# Altium schematic sheet MCU.SchDoc
size A3
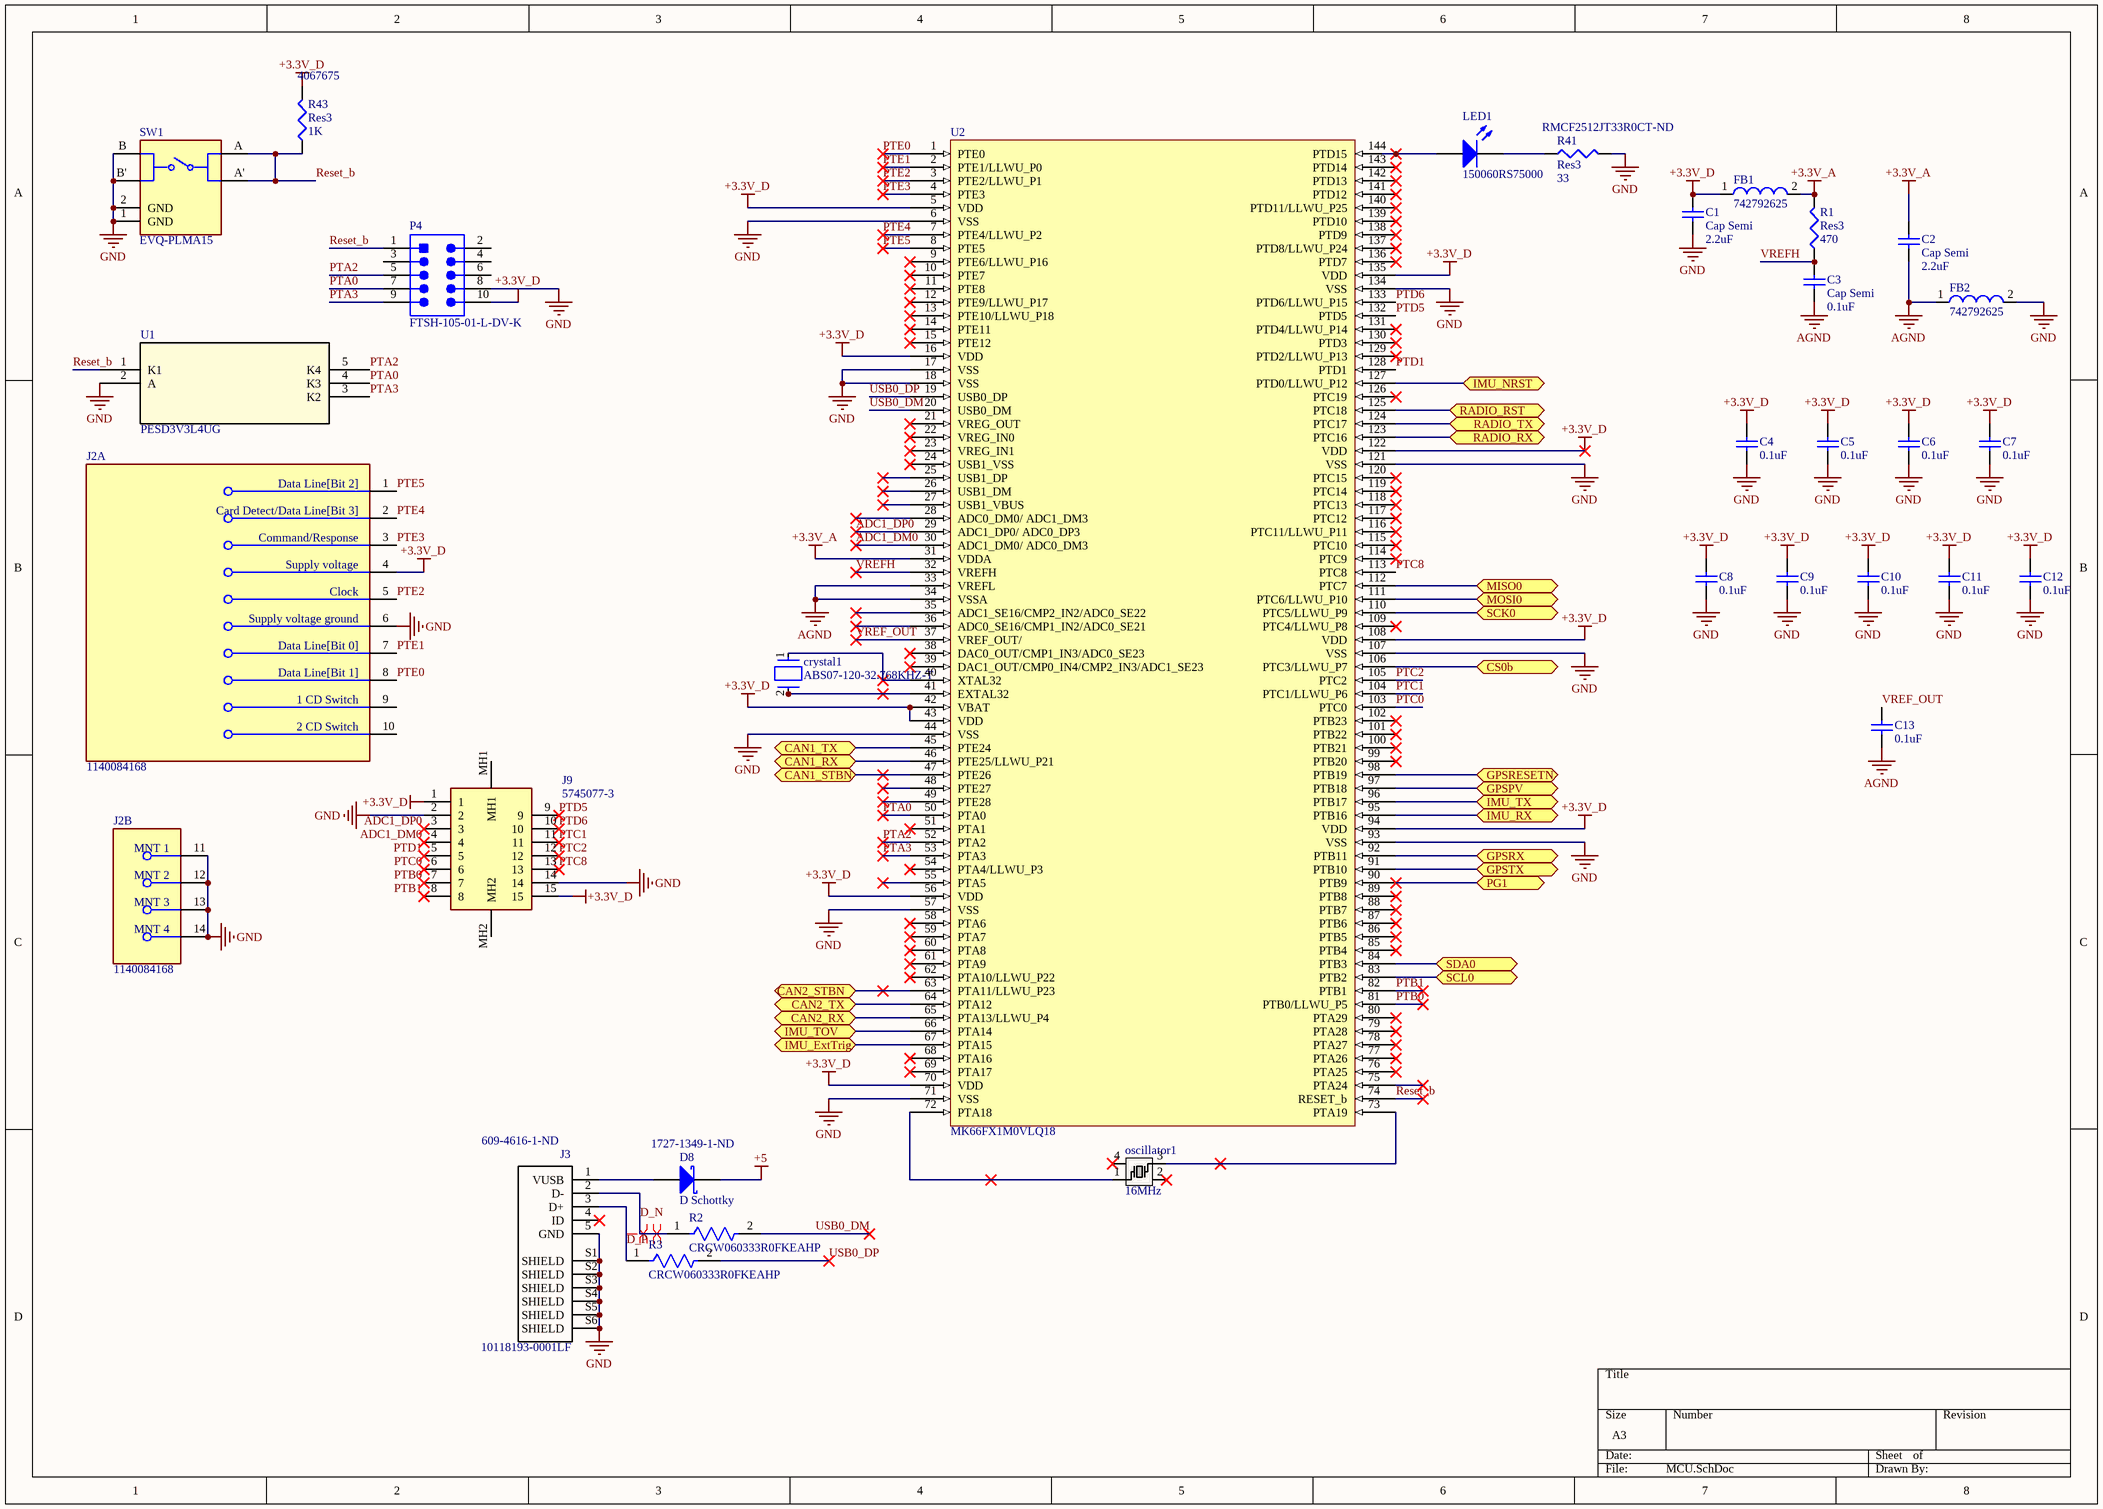
[diagram p0: MCU.SchDoc]

## Parts
C1  Cap Semi  value 2.2uF  [C1206]
C2  Cap Semi  value 2.2uF  [C1206]
C3  Cap Semi  value 0.1uF  [C1206]
C4  0.1uF  [J1-0603]
C5  0.1uF  [J1-0603]
C6  0.1uF  [J1-0603]
C7  0.1uF  [J1-0603]
C8  0.1uF  [J1-0603]
C9  0.1uF  [J1-0603]
C10  0.1uF  [J1-0603]
C11  0.1uF  [J1-0603]
C12  0.1uF  [J1-0603]
C13  0.1uF  [J1-0603]
crystal1  ABS07-120-32.768KHZ-T  [FP-ABS07-120-MFG]
D8  D Schottky  Supplier Part Number 1: 1727-1349-1-ND  [DIO_PMEG6030EVPX]
FB1  742792625  [SMD-0603]
FB2  742792625  [SMD-0603]
J2  1140084168  [FP-1140084168-0]  (parts A,B of 2)
J3  10118193-0001LF  Supplier Part Number 1: 609-4616-1-ND  [FCI_10118193-0001LF_10118193-0001LF(Primary)]
J9  5745077-3  [2301840-1]
LED1  150060RS75000  [0603_A]
oscillator1  value 16MHz  [ECS-160-8-30B-CKM]  (hidden comment: SMD_oscillator)
P4  FTSH-105-01-L-DV-K  [SMTC-FTSH-105-01-L-DV-K_V]
R1  Res3  value 470  [J1-0603]
R2  CRCW060333R0FKEAHP  [FP-CRCW0603-HPe3-IPC_B]
R3  CRCW060333R0FKEAHP  [FP-CRCW0603-HPe3-IPC_B]
R41  Res3  value 33  Supplier Part Number 2: RMCF2512JT33R0CT-ND  [J1-0603]
R43  Res3  value 1K  Supplier Part Number 1: 4067675  [J1-0603]
SW1  EVQ-PLMA15  [FP-EVQ-PLMA15-MFG]
U1  PESD3V3L4UG  [SOT353_NXP]
U2  MK66FX1M0VLQ18  [98ASS23177W]

## Ports
CAN1_RX (bidir), CAN1_STBN (bidir), CAN1_TX (bidir), CAN2_RX (bidir), CAN2_STBN (bidir), CAN2_TX (bidir), CS0b (bidir), GPSPV (bidir), GPSRESETN (bidir), GPSRX (bidir), GPSTX (bidir), IMU_ExtTrig (bidir), IMU_NRST (bidir), IMU_RX (bidir), IMU_TOV (bidir), IMU_TX (bidir), MISO0 (bidir), MOSI0 (bidir), PG1 (bidir), RADIO_RST (bidir), RADIO_RX (bidir), RADIO_TX (bidir), SCK0 (bidir), SCL0 (bidir), SDA0 (bidir)

## Nets
+3.3V_A: C2.2 FB1.2 R1.2 U2.31(VDDA)
+3.3V_D: C1.2 C4.2 C5.2 C6.2 C7.2 C8.2 C9.2 C10.2 C11.2 C12.2 FB1.1 J2.4(Supply_voltage) J9.1 J9.15 P4.10 R43.2 U2.5(VDD) U2.16(VDD) U2.42(VBAT) U2.43(VDD) U2.56(VDD) U2.70(VDD) U2.94(VDD) U2.108(VDD) U2.122(VDD) U2.135(VDD)
+5: D8.2(K)
AGND: C2.1 C3.1 C13.1 FB2.1 U2.33(VREFL) U2.34(VSSA)
GND: C1.1 C4.1 C5.1 C6.1 C7.1 C8.1 C9.1 C10.1 C11.1 C12.1 FB2.2 J2.6(Supply_voltage_ground) J2.11(MNT_1) J2.12(MNT_2) J2.13(MNT_3) J2.14(MNT_4) J3.5(GND) J3.S1(SHIELD) J3.S2(SHIELD) J3.S3(SHIELD) J3.S4(SHIELD) J3.S5(SHIELD) J3.S6(SHIELD) J9.2 J9.14 P4.8 R41.2 SW1.1(GND) SW1.2(GND) SW1.B SW1.B' U1.2(A) U2.6(VSS) U2.17(VSS) U2.18(VSS) U2.44(VSS) U2.57(VSS) U2.71(VSS) U2.93(VSS) U2.107(VSS) U2.121(VSS) U2.134(VSS)
ADC1_DM0: J9.4 U2.30(ADC1_DM0/_ADC0_DM3)
ADC1_DP0: J9.3 U2.29(ADC1_DP0/_ADC0_DP3)
CAN1_RX: U2.46(PTE25/LLWU_P21) ; port CAN1_RX
CAN1_STBN: U2.47(PTE26) ; port CAN1_STBN
CAN1_TX: U2.45(PTE24) ; port CAN1_TX
CAN2_RX: U2.65(PTA13/LLWU_P4) ; port CAN2_RX
CAN2_STBN: U2.63(PTA11/LLWU_P23) ; port CAN2_STBN
CAN2_TX: U2.64(PTA12) ; port CAN2_TX
CS0b: U2.106(PTC3/LLWU_P7) ; port CS0b
D_N: J3.2(D-) R2.1
D_P: J3.3(D+) R3.1
GPSPV: U2.97(PTB18) ; port GPSPV
GPSRESETN: U2.98(PTB19) ; port GPSRESETN
GPSRX: U2.92(PTB11) ; port GPSRX
GPSTX: U2.91(PTB10) ; port GPSTX
IMU_ExtTrig: U2.67(PTA15) ; port IMU_ExtTrig
IMU_NRST: U2.127(PTD0/LLWU_P12) ; port IMU_NRST
IMU_RX: U2.95(PTB16) ; port IMU_RX
IMU_TOV: U2.66(PTA14) ; port IMU_TOV
IMU_TX: U2.96(PTB17) ; port IMU_TX
MISO0: U2.112(PTC7) ; port MISO0
MOSI0: U2.111(PTC6/LLWU_P10) ; port MOSI0
PG1: U2.90(PTB9) ; port PG1
PTA0: P4.7 U1.4(K3) U2.50(PTA0)
PTA2: P4.5 U1.5(K4) U2.52(PTA2)
PTA3: P4.9 U1.3(K2) U2.53(PTA3)
PTB0: J9.7 U2.81(PTB0/LLWU_P5)
PTB1: J9.8 U2.82(PTB1)
PTC0: J9.6 U2.103(PTC0)
PTC1: J9.11 U2.104(PTC1/LLWU_P6)
PTC2: J9.12 U2.105(PTC2)
PTC8: J9.13 U2.113(PTC8)
PTD1: J9.5 U2.128(PTD1)
PTD5: J9.9 U2.132(PTD5)
PTD6: J9.10 U2.133(PTD6/LLWU_P15)
PTE0: J2.8(Data_Line[Bit_1]) U2.1(PTE0)
PTE1: J2.7(Data_Line[Bit_0]) U2.2(PTE1/LLWU_P0)
PTE2: J2.5(Clock) U2.3(PTE2/LLWU_P1)
PTE3: J2.3(Command/Response) U2.4(PTE3)
PTE4: J2.2(Card_Detect/Data_Line[Bit_3]) U2.7(PTE4/LLWU_P2)
PTE5: J2.1(Data_Line[Bit_2]) U2.8(PTE5)
RADIO_RST: U2.125(PTC18) ; port RADIO_RST
RADIO_RX: U2.123(PTC16) ; port RADIO_RX
RADIO_TX: U2.124(PTC17) ; port RADIO_TX
Reset_b: P4.1 R43.1 SW1.A SW1.A' U1.1(K1) U2.74(RESET_b)
SCK0: U2.110(PTC5/LLWU_P9) ; port SCK0
SCL0: U2.83(PTB2) ; port SCL0
SDA0: U2.84(PTB3) ; port SDA0
USB0_DM: R2.2 U2.20(USB0_DM)
USB0_DP: R3.2 U2.19(USB0_DP)
VREF_OUT: C13.2 U2.37(VREF_OUT/)
VREFH: C3.2 R1.1 U2.32(VREFH)
Netcrystal1_1: crystal1.1 U2.40(XTAL32)
Netcrystal1_2: crystal1.2 U2.41(EXTAL32)
NetD8_1: D8.1(A) J3.1(VUSB)
NetLED1_1: LED1.1(K) R41.1
NetLED1_2: LED1.2(A) U2.144(PTD15)
Netoscillator1_1: oscillator1.1 U2.72(PTA18)
Netoscillator1_3: oscillator1.3 U2.73(PTA19)

Not connected (* = marked no-connect by the designer): J2 9(1_CD_Switch) 10(2_CD_Switch); J3 4(ID)*; J9 MH1 MH2; oscillator1 2* 4*; P4 2 3 4 6; U2 9(PTE6/LLWU_P16)* 10(PTE7)* 11(PTE8)* 12(PTE9/LLWU_P17)* 13(PTE10/LLWU_P18)* 14(PTE11)* 15(PTE12)* 21(VREG_OUT)* 22(VREG_IN0)* 23(VREG_IN1)* 24(USB1_VSS)* 25(USB1_DP)* 26(USB1_DM)* 27(USB1_VBUS)* 28(ADC0_DM0/_ADC1_DM3)* 35(ADC1_SE16/CMP2_IN2/ADC0_SE22)* 36(ADC0_SE16/CMP1_IN2/ADC0_SE21)* 38(DAC0_OUT/CMP1_IN3/ADC0_SE23)* 39(DAC1_OUT/CMP0_IN4/CMP2_IN3/ADC1_SE23)* 48(PTE27)* 49(PTE28)* 51(PTA1)* 54(PTA4/LLWU_P3)* 55(PTA5)* 58(PTA6)* 59(PTA7)* 60(PTA8)* 61(PTA9)* 62(PTA10/LLWU_P22)* 68(PTA16)* 69(PTA17)* 75(PTA24)* 76(PTA25)* 77(PTA26)* 78(PTA27)* 79(PTA28)* 80(PTA29)* 85(PTB4)* 86(PTB5)* 87(PTB6)* 88(PTB7)* 89(PTB8)* 99(PTB20)* 100(PTB21)* 101(PTB22)* 102(PTB23)* 109(PTC4/LLWU_P8)* 114(PTC9)* 115(PTC10)* 116(PTC11/LLWU_P11)* 117(PTC12)* 118(PTC13)* 119(PTC14)* 120(PTC15)* 126(PTC19)* 129(PTD2/LLWU_P13)* 130(PTD3)* 131(PTD4/LLWU_P14)* 136(PTD7)* 137(PTD8/LLWU_P24)* 138(PTD9)* 139(PTD10)* 140(PTD11/LLWU_P25)* 141(PTD12)* 142(PTD13)* 143(PTD14)*

## Layout directives
differential pair: D_N, D_P

## Library data of the parts
C1 C2 = Cap Semi: Capacitor (Semiconductor SIM Model); SPN: 311-3513-1-ND; Published: 8-Jun-2000; LatestRevisionDate: 29-May-2009; LatestRevisionNote: IPC-7351 Footprint Added.; PackageReference: C1206; Publisher: Altium Limited; PackageDescription: Chip Capacitor
C3 = Cap Semi: Capacitor (Semiconductor SIM Model); SPN: 1276-1017-1-ND; Published: 8-Jun-2000; LatestRevisionDate: 29-May-2009; LatestRevisionNote: IPC-7351 Footprint Added.; PackageReference: C1206; Publisher: Altium Limited; PackageDescription: Chip Capacitor
C4-C13 = CAP-0402: CAP CER 0.1UF 25V X7R 0603; Manufacturer: Kyocera AVX; Manufacturer Part Number: 06033C104JAT2A; Dielectric Material: Ceramic; Capacitance: 100nF; Tolerance: 5%; Supplier 1: Digi-Key; Supplier Part Number 1: 478-3713-1-ND; RoHS: Yes; Category: Ceramic Capacitors; Stock 1: 348868; Pricing 1: 1=0.33000, 10=0.23100, 50=0.16180, 100=0.13870, 500=0.10400, 1000=0.08782 (USD); Mount: Surface Mount,PCB,Through Hole; Case/Package: 0603; Number of Pins: 2; Case Code (Metric): 1608; Case Code (Imperial): 0603; Contact Plating: Tin,Matte; Min Operating Temperature: -55°C; Max Operating Temperature: 125°C; Voltage Rating: 25V; Packaging: Tape and Reel; Package Quantity: 1; Dielectric: X7R; Termination: SMD/SMT; Voltage Rating (DC): 25V; Voltage: 25V; Length: 1.6mm; Height: 0.9mm; Width: 0.032inch; Thickness: 0.035inch; Depth: 0.81mm; Lead Pitch: 5.08mm; Radiation Hardening: No; REACH SVHC: No SVHC; Lead Free: Lead Free; ComponentLink1URL: https://datasheet.ciiva.com/208/cx7r-208464.pdf?src-supplier=Digi-Key; ComponentLink1Description: https://datasheet.ciiva.com/208/cx7r-208464.pdf?src-supplier=Digi-Key; ComponentLink2URL: https://datasheet.ciiva.com/208/cx7r-208465.pdf?src-supplier=Digi-Key; ComponentLink2Description: https://datasheet.ciiva.com/208/cx7r-208465.pdf?src-supplier=Digi-Key; ComponentLink3URL: https://datasheet.ciiva.com/1124/1679506-1124547.pdf?src-supplier=Element14; ComponentLink3Description: https://datasheet.ciiva.com/1124/1679506-1124547.pdf?src-supplier=Element14; ComponentLink4URL: https://datasheet.ciiva.com/1124/1679506-1124548.pdf?src-supplier=Element14; ComponentLink4Description: https://datasheet.ciiva.com/1124/1679506-1124548.pdf?src-supplier=Element14; ComponentLink5URL: https://datasheet.ciiva.com/5423/cx7r-218113-5423653.pdf?src-supplier=Mouser; ComponentLink5Description: https://datasheet.ciiva.com/5423/cx7r-218113-5423653.pdf?src-supplier=Mouser; ComponentLink6URL: https://datasheet.ciiva.com/7855/1679506-7855045.pdf?src-supplier=Element14; ComponentLink6Description: https://datasheet.ciiva.com/7855/1679506-7855045.pdf?src-supplier=Element14; ComponentLink7URL: https://datasheet.ciiva.com/15165/getdatasheetpartid-33578-15165094.pdf?src-supplier=Verical; ComponentLink7Description: https://datasheet.ciiva.com/15165/getdatasheetpartid-33578-15165094.pdf?src-supplier=Verical; ComponentLink8URL: https://datasheet.ciiva.com/2987/cx7r-2987753.pdf?src-supplier=Avnet; ComponentLink8Description: https://datasheet.ciiva.com/2987/cx7r-2987753.pdf?src-supplier=Avnet; ComponentLink9URL: https://datasheet.ciiva.com/14595/70001075-14595082.pdf?src-supplier=Allied+Electronics; ComponentLink9Description: https://datasheet.ciiva.com/14595/70001075-14595082.pdf?src-supplier=Allied+Electronics; ComponentLink10URL: https://datasheet.ciiva.com/14590/70001075-14590332.pdf?src-supplier=Allied+Electronics; ComponentLink10Description: https://datasheet.ciiva.com/14590/70001075-14590332.pdf?src-supplier=Allied+Electronics; ComponentLink11URL: https://datasheet.ciiva.com/208/cx7r-208463.pdf?src-supplier=Digi-Key; ComponentLink11Description: https://datasheet.ciiva.com/208/cx7r-208463.pdf?src-supplier=Digi-Key
crystal1 = CMP-2000-07587-2: CRYSTAL 32.7680KHZ 6PF SMD; Frequency Tolerance: 20ppm; Series Resistance: 60kR; ESR (Equivalent Series Resistance): 55kR; Depth: 1.5mm; Width: 0.061inch; Number of Pins: 2; Max Operating Temperature: 85°C; Length: 3.2mm; Case/Package: SMD/SMT; Series: ABS07; Lead Free: Lead Free; Min Operating Temperature: -40°C; Load Capacitance: 6pF; Packaging: Tape and Reel; Height: 0.035inch; Radiation Hardening: No; Tolerance: 20ppm; Operating Frequency: 32.768 kHz; Termination: SMD/SMT; REACH SVHC: No SVHC; RoHS Compliant: Yes; Frequency: 32.768kHz; Package Quantity: 3000; Mount: Surface Mount
D8 = D Schottky: Rectifier Diode, Single, 60 V, 3 A, 475 Mv, 70 A, 175 C Rohs Compliant: Yes; Manufacturer: Nexperia USA; Manufacturer Part Number: PMEG6030EVPX; Average Rectified Current: 3A; Reverse Recovery Time: 20ns; Max Reverse Voltage (DC): 60V; Published: 8-Jun-2000; LatestRevisionDate: 17-Jul-2002; LatestRevisionNote: Re-released for DXP Platform.; PackageReference: SMB; Publisher: Altium Limited; PackageDescription: DO-214-AA/SMB; 2 C-Bend Leads; Body 5.3 x 3.6 mm, inc. leads (LxW); Code_JEDEC: DO-214-AA; Supplier 1: Digi-Key; RoHS: No; Category: Rectifier Diodes; Stock 1: 480077; Pricing 1: 1=0.47000, 10=0.38100, 100=0.21860, 500=0.20242, 1000=0.13765 (USD); Mount: Surface Mount; Packaging: Cut Tape; ComponentLink1URL: https://assets.nexperia.com/documents/data-sheet/PMEG6030EVP.pdf?src-supplier=Digi-Key; ComponentLink1Description: https://assets.nexperia.com/documents/data-sheet/PMEG6030EVP.pdf?src-supplier=Digi-Key
FB1 FB2 = CMP-0220-00174-1: SMD EMI Suppression Ferrite Bead WE-CBF, Z = 120 Ohm; Impedance: 120 Ohm; ComponentLink1Description: Manufacturer Link; ComponentLink1URL: http://www.we-online.com; DatasheetVersion: ver 1, Aug-2009; ComponentLink2URL: http://www.we-online.de/katalog/media/pdf/742792625.pdf; PackageDescription: Chip Inductor, 2-Leads, Body 1.6 x 0.8 mm; PackageReference: SMD-0603; ComponentLink2Description: Datasheet; PackageVersion: 2009
J2 = CMP-02360-000003-1: CONN MICRO SD CARD PUSH-PULL R/A; Gender: Receptacle; Number of Contacts: 8; Connector Type: Connector; Pitch: 1.1mm; Lead Free: Lead Free; Housing Material: Polymer; Radiation Hardening: No; Mount: Surface Mount; Depth: 11.45mm; Number of Rows: 1; Height: 1.55mm; Contact Plating: Gold; Package Quantity: 7500; Packaging: Tape and Reel; Termination: SMD/SMT; Length: 15.6mm; Orientation: Right Angle; Flammability Rating: UL94 V-0; Contact Material: Copper Alloy
J3 = 10118193-0001LF: CONN USB MICRO B RECPT SMT R/A; MF: Amphenol FCI; Gender: Female; Connector Type: USB,Receptacle; Number of Contacts: 5; Number of Ports: 1; Current Rating: 1.8A; Insulation Resistance: 1GR; Max Voltage Rating (AC): 100V; Pitch: 0.65mm; SnapEDA_Link: https://www.snapeda.com/parts/10118193-0001LF/Amphenol%20FCI/view-part/?ref=snap; Digi-Key_Purchase_URL: https://www.digikey.ca/product-detail/en/amphenol-fci/10118193-0001LF/609-4616-1-ND/2785380?utm_source=snapeda&utm_medium=aggregator&utm_campaign=symbol; Package: None; MP: 10118193-0001LF; Digi-Key_Part_Number: 609-4616-1-ND; Value: *; Supplier 1: Digi-Key; Manufacturer: Amphenol FCI; Manufacturer Part Number: 10118193-0001LF; RoHS: Yes; Category: USB Connectors; Stock 1: 48313; Pricing 1: 1=0.45000, 10=0.43000, 25=0.36840, 50=0.31320, 100=0.30090, 250=0.27016, 500=0.25788 (USD); Mount: Surface Mount,Horizontal; Contact Plating: Gold; Contact Material: Copper Alloy; Color: Black; Number of Terminals: 5; Housing Material: Polymer; Min Operating Temperature: -55°C; Max Operating Temperature: 85°C; Termination: Solder; Packaging: Tape and Reel; Orientation: Right Angle; Package Quantity: 1200; Voltage Rating: 100V; Features: Shielded; Length: 7.86mm; Depth: 5.67mm; Radiation Hardening: No; Flammability Rating: UL94 V-0; ComponentLink1URL: https://datasheet.ciiva.com/851/10118193-851106.pdf?src-supplier=Digi-Key; ComponentLink1Description: https://datasheet.ciiva.com/851/10118193-851106.pdf?src-supplier=Digi-Key; ComponentLink2URL: https://datasheet.ciiva.com/4598/10118193ac-197151-4598799.pdf?src-supplier=Mouser; ComponentLink2Description: https://datasheet.ciiva.com/4598/10118193ac-197151-4598799.pdf?src-supplier=Mouser; ComponentLink3URL: https://datasheet.ciiva.com/26853/getdatasheetpartid-418618-26853893.pdf?src-supplier=Verical; ComponentLink3Description: https://datasheet.ciiva.com/26853/getdatasheetpartid-418618-26853893.pdf?src-supplier=Verical; ComponentLink4URL: https://datasheet.ciiva.com/14802/10118193-0001lf-webpage-14802386.pdf?src-supplier=Arrow+Electronics; ComponentLink4Description: https://datasheet.ciiva.com/14802/10118193-0001lf-webpage-14802386.pdf?src-supplier=Arrow+Electronics; ComponentLink5URL: https://datasheet.ciiva.com/851/10118193-851108.pdf?src-supplier=Digi-Key; ComponentLink5Description: https://datasheet.ciiva.com/851/10118193-851108.pdf?src-supplier=Digi-Key; ComponentLink6URL: https://datasheet.ciiva.com/851/10118193-851107.pdf?src-supplier=Digi-Key; ComponentLink6Description: https://datasheet.ciiva.com/851/10118193-851107.pdf?src-supplier=Digi-Key; ComponentLink7URL: https://datasheet.ciiva.com/14618/70236827-14618887.pdf?src-supplier=Allied+Electronics; ComponentLink7Description: https://datasheet.ciiva.com/14618/70236827-14618887.pdf?src-supplier=Allied+Electronics
J9 = 5745077-3: Connector; Manufacturer_Name: TE Connectivity; Datasheet Link: https://www.te.com/commerce/DocumentDelivery/DDEController?Action=srchrtrv&DocNm=5745077&DocType=Customer+Drawing&DocLang=English; Height: 12.55mm; Manufacturer_Part_Number: 5745077-3
LED1 = CMP-1426-00001-1: SMD mono-color Chip LED, WL-SMCW, Red; Manufacturer: Wuerth Elektronik; Color: Red; PackageReference: 0603_A; ComponentLink2URL: http://katalog.we-online.com/led/datasheet/150060RS75000.pdf; ComponentLink1URL: http://www.we-online.com; ComponentLink1Description: Manufacturer URL; ComponentLink2Description: Datasheet; PartNumber: 150060RS75000
oscillator1 = ECS-160-8-30B-CKM: SPN: XC1839CT-ND
P4 = CMP-2000-05353-1: Male Header, Pitch 1.27 mm, 2 x 5 Position, Height 6.25 mm; Manufacturer: Samtec; Pitch: 0.050"(1.27mm); Other Names: Q3937619; Number of Positions: 10; Mating Products: SFMC-105-L2-S-D-TR-ND / -CONN.05"SURFACE10POSSMT / FLE-105-01-G-DV-TR-ND / -CONNSKT1.27MM10POSDUALSMD / FLE-105-01-G-DV-A-P-ND / -CONNSKT1.27MM10POSDUALSMD / FLE-105-01-G-DV-A-ND / -CONNSKT1.27MM10POSDUALSMD / CLP-105-02-G-D-P-TR-ND / -CONNRCPT10POSDUAL.05"SMD / SAM1155-05-ND / -CONNRCPT10POSDUAL.05"SMD / SAM1154-05-ND / -CONNRCPT10POSDUAL.05"SMD / SAM1153-05-ND / -CONNRCPT10POSDUAL.05"SMD / SAM1226-05-ND / -CONNRCPT.05"10POSDUALSMD; Number of Positions Loaded: All; Connector Type: Header,Unshrouded; Product Training Modules: Board-to-BoardConnectors; Datasheet Version: Rev. ET, 10/1995; Number of Rows: 2; Standard Package: 1; Package Description: Male Header, Pitch 1.27 mm, 2 x 5 Position, Height 5.97 mm, Tail Length 4.32 mm; Contact Finish Thickness: 10µin(0.25µm); Series: FTSH; Termination: Solder; Contact Type: MalePin; Color: Black; Package Reference: FTSH-105-01-L-DV-K; Family: RectangularConnectors-Headers,MalePins; Package URL: http://suddendocs.samtec.com/prints/ftsh-1xx-xx-xxx-dv-xxx-footprint.pdf; Packaging: Tube; Mounting Type: SurfaceMount; Category: Connectors,Interconnects; Datasheet URL: http://suddendocs.samtec.com/prints/ftsh-1xx-xx-xxx-dv-xxx-mkt.pdf; Row Spacing: 0.050"(1.27mm); Manufacturer URL: http://www.samtec.com/; Contact Mating Length: 0.120"(3.05mm); Contact Finish: Gold
R1 = Res3: Resistor; SPN: RHM470ADCT-ND; Published: 8-Jun-2000; LatestRevisionDate: 29-May-2009; LatestRevisionNote: IPC-7351 Footprint Added.; PackageReference: J1-0603; Publisher: Altium Limited; PackageDescription: Chip Resistor
R2 R3 = CMP-02407-002371-1: RES Thick Film, 33Ω, 1%, 0.33W, 100ppm/°C, 0603; Power Rating: 250mW; Voltage Rating: 75V; Resistance: 33R; Max Operating Temperature: 155°C; Tolerance: 1%; Depth: 0.85mm; Radiation Hardening: No; Contact Plating: Tin; Length: 1.6mm; Features: Automotive AEC-Q200; Case/Package: 0603; Lead Free: Lead Free; Width: 0.033inch; Voltage Rating (DC): 75V; Mount: Surface Mount; Termination: SMD/SMT; Packaging: Tape and Reel; Package Quantity: 10; Composition: Thick Film; Min Operating Temperature: -55°C; Case Code (Metric): 1608; Height: 0.45mm; Military Standard: Not; Max Power Dissipation: 250mW; Number of Terminations: 2; Weight: 7.1E-05oz; Temperature Coefficient: 100ppm/°C; Case Code (Imperial): 0603
R41 = Res3: RES SMD 33 OHM 5% 1W 2512; Manufacturer: Vishay; Manufacturer Part Number: CRCW060333R0FKEA; SPN: 541-2782-1-ND; Resistance: 33R; Tolerance: 1%; Temperature Coefficient: 100ppm/°C; Power Rating: 100mW; Voltage Rating: 75V; Published: 8-Jun-2000; LatestRevisionDate: 29-May-2009; LatestRevisionNote: IPC-7351 Footprint Added.; PackageReference: J1-0603; Publisher: Altium Limited; PackageDescription: Chip Resistor; Supplier 1: Digi-Key; Supplier Part Number 1: 541-33.0HCT-ND; RoHS: Yes; Category: Chip SMD Resistors; Stock 1: 59910; Pricing 1: 1=0.10000, 10=0.03300, 100=0.01340, 1000=0.00602, 2500=0.00522 (USD); Mount: Surface Mount; Case/Package: 0603; Weight: 7.1E-05oz; Case Code (Imperial): 0603; Case Code (Metric): 1608; Contact Plating: Tin; Min Operating Temperature: -55°C; Max Operating Temperature: 155°C; Composition: Thick Film; Packaging: Tape and Reel; Number of Terminations: 2; Max Power Dissipation: 100mW; Voltage Rating (DC): 75V; Package Quantity: 10; Military Standard: Not; Termination: SMD/SMT; Features: Automotive AEC-Q200; Length: 1.55mm; Height: 0.45mm; Width: 0.85mm; Depth: 0.85mm; Radiation Hardening: No; Lead Free: Lead Free; REACH SVHC: Unknown; ComponentLink1URL: https://datasheet.ciiva.com/11809/0900766b80d98afc-11809158.pdf?src-supplier=RSComponents; ComponentLink1Description: https://datasheet.ciiva.com/11809/0900766b80d98afc-11809158.pdf?src-supplier=RSComponents; ComponentLink2URL: https://datasheet.ciiva.com/7777/1697337-7777317.pdf?src-supplier=Element14; ComponentLink2Description: https://datasheet.ciiva.com/7777/1697337-7777317.pdf?src-supplier=Element14; ComponentLink3URL: https://datasheet.ciiva.com/7777/1720486-7777557.pdf?src-supplier=Element14; ComponentLink3Description: https://datasheet.ciiva.com/7777/1720486-7777557.pdf?src-supplier=Element14; ComponentLink4URL: https://datasheet.ciiva.com/16783/70201119-16783349.pdf?src-supplier=Allied+Electronics; ComponentLink4Description: https://datasheet.ciiva.com/16783/70201119-16783349.pdf?src-supplier=Allied+Electronics; ComponentLink5URL: https://datasheet.ciiva.com/7777/1720486-7777558.pdf?src-supplier=Element14; ComponentLink5Description: https://datasheet.ciiva.com/7777/1720486-7777558.pdf?src-supplier=Element14; ComponentLink6URL: https://datasheet.ciiva.com/16771/70201119-16771126.pdf?src-supplier=Allied+Electronics; ComponentLink6Description: https://datasheet.ciiva.com/16771/70201119-16771126.pdf?src-supplier=Allied+Electronics; ComponentLink7URL: https://datasheet.ciiva.com/2465/dcrcwe3-2465591.pdf?src-supplier=Digi-Key; ComponentLink7Description: https://datasheet.ciiva.com/2465/dcrcwe3-2465591.pdf?src-supplier=Digi-Key; ComponentLink8URL: https://datasheet.ciiva.com/2465/dcrcwe3-2465592.pdf?src-supplier=Digi-Key; ComponentLink8Description: https://datasheet.ciiva.com/2465/dcrcwe3-2465592.pdf?src-supplier=Digi-Key; ComponentLink9URL: https://datasheet.ciiva.com/2465/dcrcwe3-2465593.pdf?src-supplier=Digi-Key; ComponentLink9Description: https://datasheet.ciiva.com/2465/dcrcwe3-2465593.pdf?src-supplier=Digi-Key; ComponentLink10URL: https://datasheet.ciiva.com/16893/dcrcwe3-16893242.pdf?src-supplier=Avnet+Europe; ComponentLink10Description: https://datasheet.ciiva.com/16893/dcrcwe3-16893242.pdf?src-supplier=Avnet+Europe; Supplier 2: Digi-Key; Stock 2: 13779; Pricing 2: 1=0.26000, 10=0.22000, 100=0.08600, 1000=0.03600 (USD); Resistor Type: Thick Film; ComponentLink11URL: http://components.arrow.com/part/dataview/50590633S359032N1174?src-supplier=Arrow+Electronics; ComponentLink11Description: http://components.arrow.com/part/dataview/50590633S359032N1174?src-supplier=Arrow+Electronics; ComponentLink12URL: https://www.seielect.com/Catalog/SEI-RMCF_RMCP.pdf?src-supplier=Digi-Key; ComponentLink12Description: https://www.seielect.com/Catalog/SEI-RMCF_RMCP.pdf?src-supplier=Digi-Key; ComponentLink13URL: https://www.seielect.com/catalog/SEI-Packaging.pdf?src-supplier=Digi-Key; ComponentLink13Description: https://www.seielect.com/catalog/SEI-Packaging.pdf?src-supplier=Digi-Key; ComponentLink14URL: https://www.seielect.com/catalog/SEI-RMCF_RMCP.pdf?src-supplier=Avnet; ComponentLink14Description: https://www.seielect.com/catalog/SEI-RMCF_RMCP.pdf?src-supplier=Avnet; ComponentLink15URL: http://www.seielect.com/Catalog/SEI-RMCF_RMCP.pdf?src-supplier=Future+Electronics; ComponentLink15Description: http://www.seielect.com/Catalog/SEI-RMCF_RMCP.pdf?src-supplier=Future+Electronics
R43 = Res3: Resistor; Published: 8-Jun-2000; LatestRevisionDate: 29-May-2009; LatestRevisionNote: IPC-7351 Footprint Added.; PackageReference: J1-0603; Publisher: Altium Limited; PackageDescription: Chip Resistor; Supplier 1: Future Electronics
SW1 = CMP-05618-000006-1: SWITCH TACTILE SPST-NO 0.02A 15V; Manufacturer: Panasonic Electronic Components; Operating Force: 2.6N; Contact Resistance: 50mΩ; Contact Current Rating: 20mA; Electromechanical Life: 200000Cycles; Throw Configuration: SPST-NO; Automotive: No; Digikey Description: SWITCH TACTILE SPST-NO 0.02A 15V; Device Class L3: Tactile Switches; Device Class L2: Switches; Temperature Range Low: -20°C; ComponentLink2Description: Datasheet; RoHS: TRUE; Mount: Surface Mount; Package: 0; Height: 1.7mm; Octopart: https://octopart.com/evq-plma15-panasonic-39850235; Temperature Range High: +70°C; Device Class L1: Electromechanical; Category: Switch; Mouser Description: Tactile Switches FLAT ACT 2.6NF 4.6x3.4x1.5mm; Voltage Rating Dc: 15V; Manufacturer Part Number: EVQ-PLMA15; ComponentLink2URL: https://datasheet.ciiva.com/8164/atv0000ce2-8164994.pdf; Lead Free: Yes; Temperature: -20°C to +70°C
U1 = PESD3V3L4UG: No Description Available; Vendor: NXP; Built_By: EMA_UL_Team; SourceLibrary: NXP_2011-11-10; Manufacturer_Part_Number: PESD3V3L4UG; Copyright: Copyright (C) 2018 Accelerated Designs. All rights reserved; RefDes: RefDes; Type: DEV
U2 = Component_1